# EAGLE schematic EquisatSimulatorV2 (EAGLE 7.7.0)

## Sheet 1 of 2
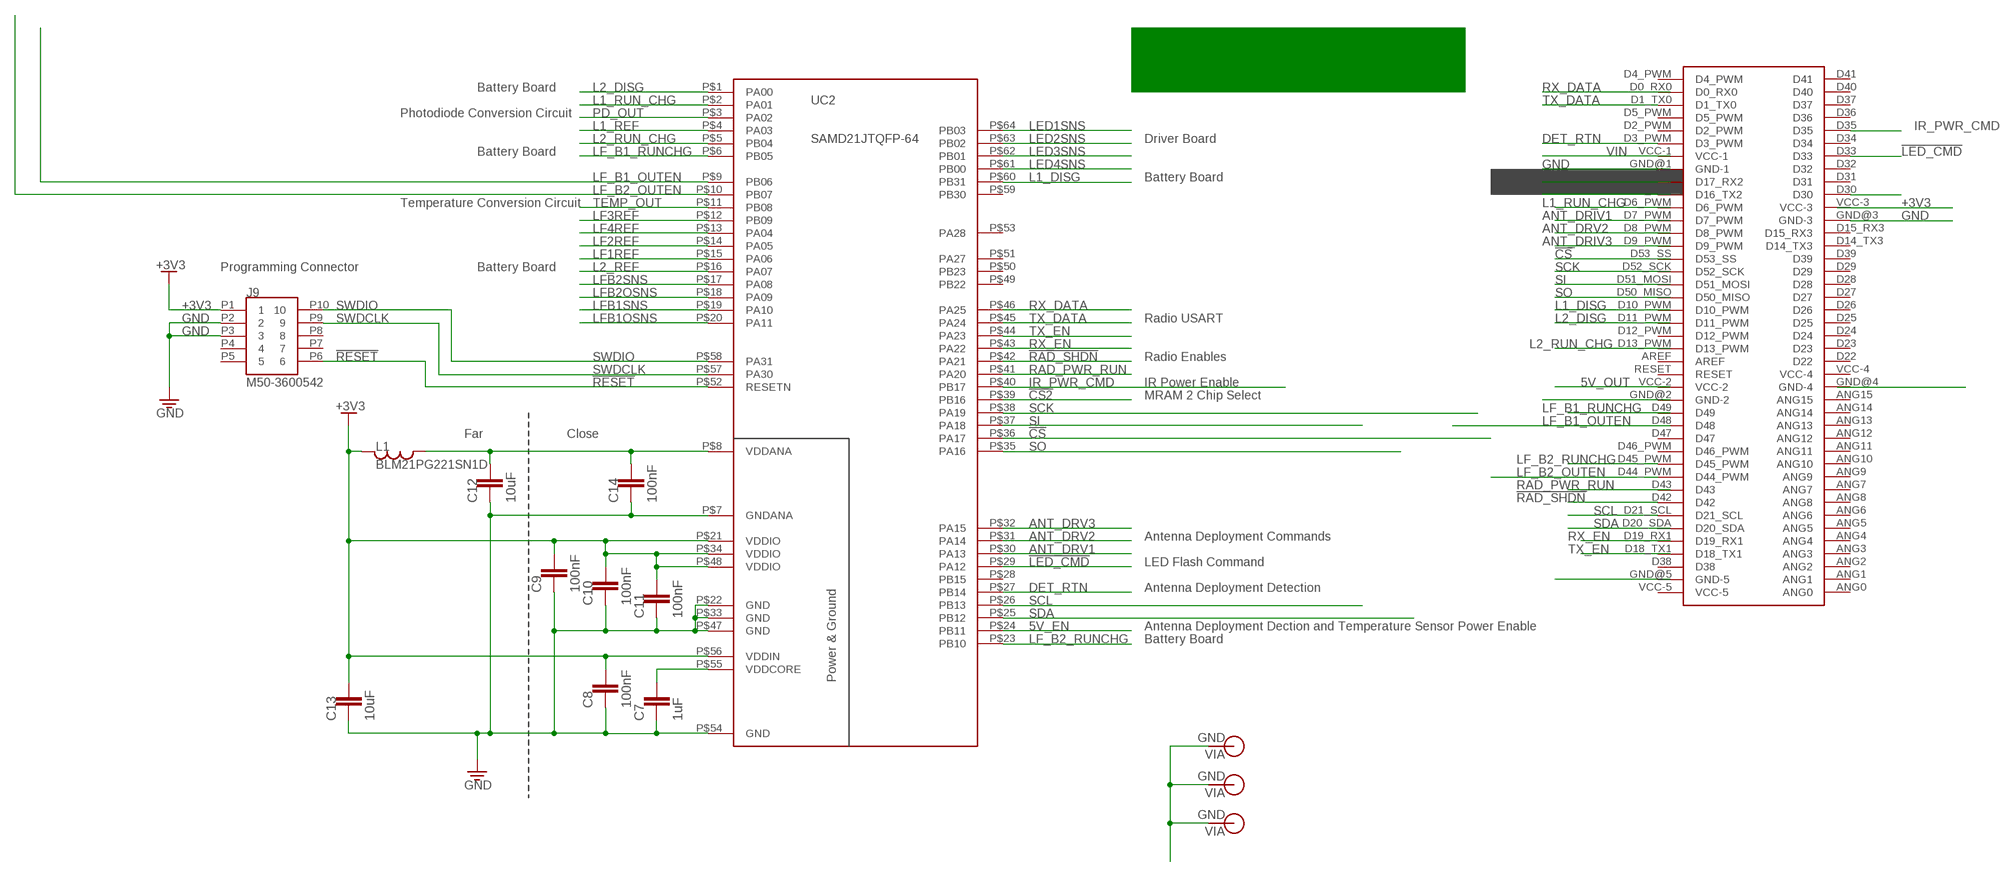
[diagram p0: schematic, sheet 1]

### Parts
C7  1uF  CAP0805  [0805]
C8  100nF  CAP0805  [0805]
C9  100nF  CAP0805  [0805]
C10  100nF  CAP0805  [0805]
C11  100nF  CAP0805  [0805]
C12  10uF  CAP0805  [0805]
C13  10uF  CAP0805  [0805]
C14  100nF  CAP0805  [0805]
J9  M50-3600542  10PINMALE  [10PINMALE]
L1  BLM21PG221SN1D  FERRITE  [0805]
U$1  ARDUINOMEGABOARD  [ARDUINOMEGA]
UC2  SAMD21JTQFP-64  [TQFP-64]
V9  GND  VIA60MIL-SQ  [VIA-60MIL-SQ]
V10  GND  VIA60MIL-SQ  [VIA-60MIL-SQ]
V12  GND  VIA60MIL-SQ  [VIA-60MIL-SQ]

### Nets
5V_EN: UC2.P$24(PB11)
!CS2!: UC2.P$39(PB16)
!CS!: UC2.P$36(PA17)
!LED_CMD!: U$1.D33 UC2.P$29(PA12)
!RAD_SHDN!: U$1.D42 UC2.P$42(PA21)
!RESET!: J9.P6 UC2.P$52(RESETN)
+3V3: C8.1 C9.1 C10.1 C11.1 C13.1 J9.P1 L1.1 UC2.P$21(VDDIO) UC2.P$34(VDDIO) UC2.P$48(VDDIO) UC2.P$56(VDDIN)
ANT_DRV1: UC2.P$30(PA13)
ANT_DRV2: UC2.P$31(PA14)
ANT_DRV3: UC2.P$32(PA15)
DET_RTN: U$1.D3_PWM UC2.P$27(PB14)
GND: C7.2 C8.2 C9.2 C10.2 C11.2 C12.2 C13.2 C14.2 J9.P2 J9.P3 U$1.GND@3(GND-3) UC2.P$7(GNDANA) UC2.P$22(GND) UC2.P$33(GND) UC2.P$47(GND) UC2.P$54(GND) V9.P$1 V10.P$1 V12.P$1
IR_PWR_CMD: U$1.D35 UC2.P$40(PB17)
L1_DISG: UC2.P$60(PB31)
L1_REF: UC2.P$4(PA03)
L1_RUN_CHG: UC2.P$2(PA01)
L2_DISG: UC2.P$1(PA00)
L2_REF: UC2.P$16(PA07)
L2_RUN_CHG: UC2.P$5(PB04)
LED1SNS: UC2.P$64(PB03)
LED2SNS: UC2.P$63(PB02)
LED3SNS: UC2.P$62(PB01)
LED4SNS: UC2.P$61(PB00)
LF1REF: UC2.P$15(PA06)
LF2REF: UC2.P$14(PA05)
LF3REF: UC2.P$12(PB09)
LF4REF: UC2.P$13(PA04)
LF_B1_OUTEN: UC2.P$9(PB06)
LF_B1_RUNCHG: UC2.P$6(PB05)
LF_B2_OUTEN: U$1.D44_PWM UC2.P$10(PB07)
LF_B2_RUNCHG: U$1.D45_PWM UC2.P$23(PB10)
LFB1OSNS: UC2.P$20(PA11)
LFB1SNS: UC2.P$19(PA10)
LFB2OSNS: UC2.P$18(PA09)
LFB2SNS: UC2.P$17(PA08)
N$1: C12.1 C14.1 L1.2 UC2.P$8(VDDANA)
N$2: C7.1 UC2.P$55(VDDCORE)
N$9: U$1.D30
PD_OUT: UC2.P$3(PA02)
RAD_PWR_RUN: UC2.P$41(PA20)
RX_DATA: UC2.P$46(PA25)
RX_EN: UC2.P$43(PA22)
SCK: UC2.P$38(PA19)
SCL: U$1.D21_SCL UC2.P$26(PB13)
SDA: UC2.P$25(PB12)
SI: UC2.P$37(PA18)
SO: UC2.P$35(PA16)
SWDCLK: J9.P9 UC2.P$57(PA30)
SWDIO: J9.P10 UC2.P$58(PA31)
TEMP_OUT: UC2.P$11(PB08)
TX_DATA: U$1.D1_TX0 UC2.P$45(PA24)
TX_EN: UC2.P$44(PA23)
Unconnected: J9.P4 J9.P5 J9.P7 J9.P8 U$1.ANG0 U$1.ANG1 U$1.ANG2 U$1.ANG3 U$1.ANG4 U$1.ANG5 U$1.ANG6 U$1.ANG7 U$1.ANG8 U$1.ANG9 U$1.ANG10 U$1.ANG11 U$1.ANG12 U$1.ANG13 U$1.ANG14 U$1.ANG15 U$1.AREF U$1.D0_RX0 U$1.D2_PWM U$1.D4_PWM U$1.D5_PWM U$1.D6_PWM U$1.D7_PWM U$1.D8_PWM U$1.D9_PWM U$1.D10_PWM U$1.D11_PWM U$1.D12_PWM U$1.D13_PWM U$1.D14_TX3 U$1.D15_RX3 U$1.D16_TX2 U$1.D17_RX2 U$1.D18_TX1 U$1.D19_RX1 U$1.D20_SDA U$1.D22 U$1.D23 U$1.D24 U$1.D25 U$1.D26 U$1.D27 U$1.D28 U$1.D29 U$1.D31 U$1.D32 U$1.D34 U$1.D36 U$1.D37 U$1.D38 U$1.D39 U$1.D40 U$1.D41 U$1.D43 U$1.D46_PWM U$1.D47 U$1.D48 U$1.D49 U$1.D50_MISO U$1.D51_MOSI U$1.D52_SCK U$1.D53_SS U$1.GND@1(GND-1) U$1.GND@2(GND-2) U$1.GND@4(GND-4) U$1.GND@5(GND-5) U$1.RESET U$1.VCC-1 U$1.VCC-2 U$1.VCC-3 U$1.VCC-4 U$1.VCC-5 UC2.P$28(PB15) UC2.P$49(PB22) UC2.P$50(PB23) UC2.P$51(PA27) UC2.P$53(PA28) UC2.P$59(PB30)

### Notes on the sheet
- The ones in BOXES are not on the Processor
- Battery Board
- Photodiode Conversion Circuit
- Driver Board
- Battery Board
- Battery Board
- Temperature Conversion Circuit
- Programming Connector | Battery Board
- Radio USART
- Radio Enables
- IR Power Enable
- MRAM 2 Chip Select
- Far | Close
- Antenna Deployment Commands
- LED Flash Command
- Antenna Deployment Detection
- Antenna Deployment Dection and Temperature Sensor Power Enable
- Battery Board

## Sheet 2 of 2

## Library data of the parts
C7-C14 = BrownSpaceEngineering:CAP: Capacitor
J9 = BrownSpaceEngineering:10PINMALE
L1 = BrownSpaceEngineering:FERRITE
U$1 = BrownSpaceEngineering:ARDUINOMEGABOARD
UC2 = BrownSpaceEngineering:SAMD21J
V9 V10 V12 = BrownSpaceEngineering:VIA